# Altium schematic sheet mcu.SchDoc
size A4; SheetNumber: 9; SheetTotal: 14
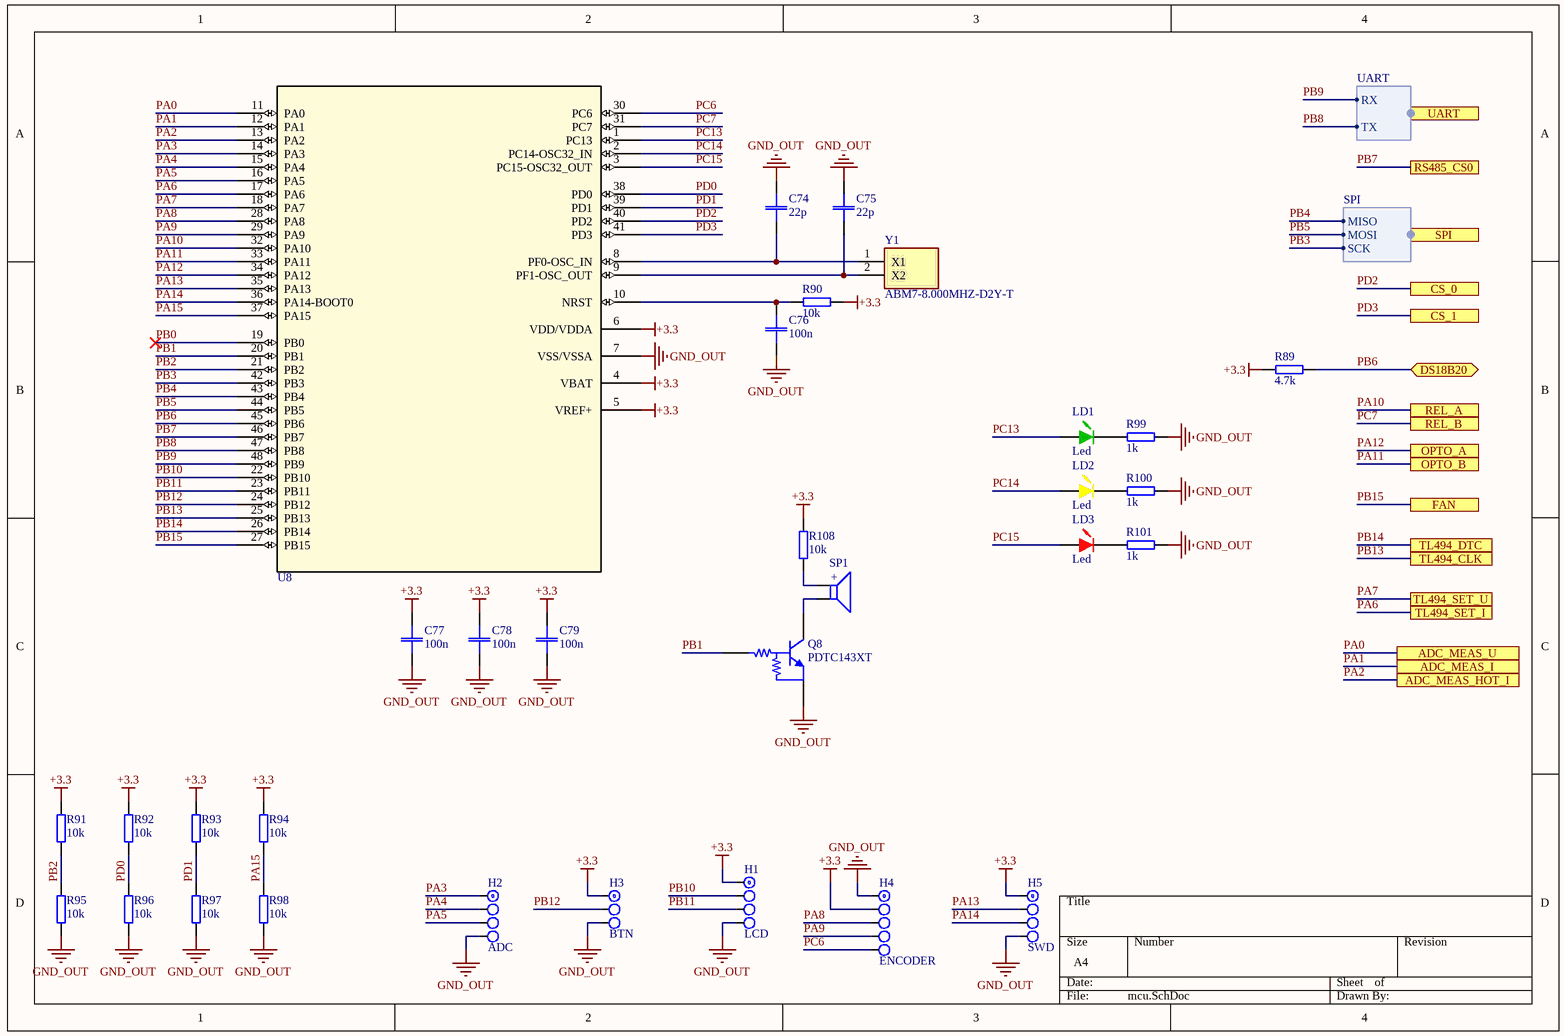
[diagram p0: mcu.SchDoc]

## Parts
C74  22p  [CAP: 0603]
C75  22p  [CAP: 0603]
C76  100n  [CAP: 0603]
C77  100n  [CAP: 0603]
C78  100n  [CAP: 0603]
C79  100n  [CAP: 0603]
H1  LCD  [J1x4]
H2  ADC  [J1x4]
H3  BTN  [J1x3]
H4  ENCODER  [J1x5]
H5  SWD  [J1x4]
LD1  Led  [Led 0805-Green]
LD2  Led  [Led 0805-Yellow]
LD3  Led  [Led 0805-Red]
Q8  PDTC143XT  [SOT23_N]
R89  4.7k  [RES: 0603]
R90  10k  [RES: 0603]
R91  10k  [RES: 0603]
R92  10k  [RES: 0603]
R93  10k  [RES: 0603]
R94  10k  [RES: 0603]
R95  10k  [RES: 0603]
R96  10k  [RES: 0603]
R97  10k  [RES: 0603]
R98  10k  [RES: 0603]
R99  1k  [RES: 0603]
R100  1k  [RES: 0603]
R101  1k  [RES: 0603]
R108  10k  [RES: 0603]
SP1  (no value)  [BUZ: D12mm  P7.6mm]
U8  STM32G070CBTx  [48-LQFP]  (value not drawn)
Y1  ABM7-8.000MHZ-D2Y-T  [ABM78000MHZD2YT]

## Ports
ADC_MEAS_HOT_I, ADC_MEAS_I, ADC_MEAS_U, CS_0, CS_1, DS18B20 (bidir), FAN, OPTO_A, OPTO_B, REL_A, REL_B, RS485_CS0, SPI (harness SPI), TL494_CLK, TL494_DTC, TL494_SET_I, TL494_SET_U, UART (harness UART)

## Harnesses
UART: RX, TX
SPI: MISO, SCK, MOSI

## Nets
+3.3: C77.2 C78.2 C79.2 H1.1 H3.1 H4.2 H5.1 R89.1 R90.2 R91.1 R92.1 R93.1 R94.1 R108.1 U8.4(VBAT) U8.5(VREF+) U8.6(VDD/VDDA)
GND_OUT: C74.2 C75.2 C76.1 C77.1 C78.1 C79.1 H1.4 H2.4 H3.3 H4.1 H5.4 Q8.2(E) R95.2 R96.2 R97.2 R98.2 R99.2 R100.2 R101.2 U8.7(VSS/VSSA)
PA0: U8.11(PA0) ; port ADC_MEAS_U
PA1: U8.12(PA1) ; port ADC_MEAS_I
PA2: U8.13(PA2) ; port ADC_MEAS_HOT_I
PA3: H2.1 U8.14(PA3)
PA4: H2.2 U8.15(PA4)
PA5: H2.3 U8.16(PA5)
PA6: U8.17(PA6) ; port TL494_SET_I
PA7: U8.18(PA7) ; port TL494_SET_U
PA8: H4.3 U8.28(PA8)
PA9: H4.4 U8.29(PA9)
PA10: U8.32(PA10) ; port REL_A
PA11: U8.33(PA11) ; port OPTO_B
PA12: U8.34(PA12) ; port OPTO_A
PA13: H5.2 U8.35(PA13)
PA14: H5.3 U8.36(PA14-BOOT0)
PA15: R94.2 R98.1 U8.37(PA15)
PB0: U8.19(PB0)
PB1: Q8.1(B) U8.20(PB1)
PB2: R91.2 R95.1 U8.21(PB2)
PB3: U8.42(PB3) ; port SPI.SCK
PB4: U8.43(PB4) ; port SPI.MISO
PB5: U8.44(PB5) ; port SPI.MOSI
PB6: R89.2 U8.45(PB6) ; port DS18B20
PB7: U8.46(PB7) ; port RS485_CS0
PB8: U8.47(PB8) ; port UART.TX
PB9: U8.48(PB9) ; port UART.RX
PB10: H1.2 U8.22(PB10)
PB11: H1.3 U8.23(PB11)
PB12: H3.2 U8.24(PB12)
PB13: U8.25(PB13) ; port TL494_CLK
PB14: U8.26(PB14) ; port TL494_DTC
PB15: U8.27(PB15) ; port FAN
PC6: H4.5 U8.30(PC6)
PC7: U8.31(PC7) ; port REL_B
PC13: LD1.1(A) U8.1(PC13)
PC14: LD2.1(A) U8.2(PC14-OSC32_IN)
PC15: LD3.1(A) U8.3(PC15-OSC32_OUT)
PD0: R92.2 R96.1 U8.38(PD0)
PD1: R93.2 R97.1 U8.39(PD1)
PD2: U8.40(PD2) ; port CS_0
PD3: U8.41(PD3) ; port CS_1
NetC74_1: C74.1 U8.8(PF0-OSC_IN) Y1.1(X1)
NetC75_1: C75.1 U8.9(PF1-OSC_OUT) Y1.2(X2)
NetC76_2: C76.2 R90.1 U8.10(NRST)
NetLD1_2: LD1.2(K) R99.1
NetLD2_2: LD2.2(K) R100.1
NetLD3_2: LD3.2(K) R101.1
NetQ8_3: Q8.3(C) SP1.2
NetR108_2: R108.2 SP1.1

## Notes on the sheet
- (in symbol BUZZER) +

## Library data of the parts
C74-C79 = C_SMD
  C74 C75: Value: 22p
  C76-C79: Value: 100n
H1 H2 H5 = H-1x4: Price: 0.04
H3 = H-1x3: Price: 0.03
H4 = H-1x5: Price: 0.05
LD1 = Led 0805 KP-2012SGC: Green 565nm 15mcd; Price: 0.09
LD2 = Led 0805 KP-2012YC: Yellow 590nm 8mcd; Price: 0.09
LD3 = Led 0805 KP-2012EC: Red  627nm 12mcd; Price: 0.09
Q8 = PDTC143XT: NPN Resistor-equipped Transistor; Published: 17-Sep-2003; LatestRevisionDate: 12-Dec-2006; LatestRevisionNote: IPC-7351 Footprint Added.; DatasheetVersion: 20-Apr-1999; PackageVersion: May-1999; PackageReference: SOT23; Publisher: Altium Limited; PackageDescription: 3-Pin SOT-23 Package 0.95 mm Pitch, 2.3 mm Lead Span; ComponentLink1Description: Manufacturer Link; ComponentLink1URL: http://www.semiconductors.philips.com/; ComponentLink2Description: Datasheet; ComponentLink2URL: http://www.semiconductors.philips.com/acrobat/datasheets/PDTC143X_SERIES_8.pdf
R89-R101 R108 = R_SMD
  R89: Value: 4.7k
  R90-R98 R108: Value: 10k
  R99-R101: Value: 1k
SP1 = BUZZER
U8 = STM32G070CBTx: The STM32G070CB/KB/RB mainstream microcontrollers are based on high-performance Arm® Cortex®-M0+ 32-bit RISC core operating at up to 64 MHz frequency. / 128 Kbytes of Flash program memory and 36 Kbytes of SRAM. With 48pin LQFP 7x7x1.4 package; Manufacturer_Part_Number: stm32g0_lqfp48_t2; Vendor: STMicroelectronics; Copyright: Copyright (C) 2018 Accelerated Designs. All rights reserved; RefDes: RefDes; Type: DEV; Value: Value
Y1 = ABM7-8.000MHZ-D2Y-T: Crystal or Oscillator; Manufacturer_Name: ABRACON; Datasheet Link: http://www.abracon.com/Resonators/abm7.pdf; Height: 1.4mm; Manufacturer_Part_Number: ABM7-8.000MHZ-D2Y-T; Mouser Part Number: 815-ABM7-8-D2Y-T; Mouser Price/Stock: https://www.mouser.co.uk/ProductDetail/ABRACON/ABM7-8000MHZ-D2Y-T?qs=LoTOQoUkC8SFsmY8snleBA%3D%3D; Arrow Part Number: ABM7-8.000MHZ-D2Y-T; Arrow Price/Stock: https://www.arrow.com/en/products/abm7-8.000mhz-d2y-t/abracon?region=nac